# Altium schematic sheet power.SchDoc
size A4
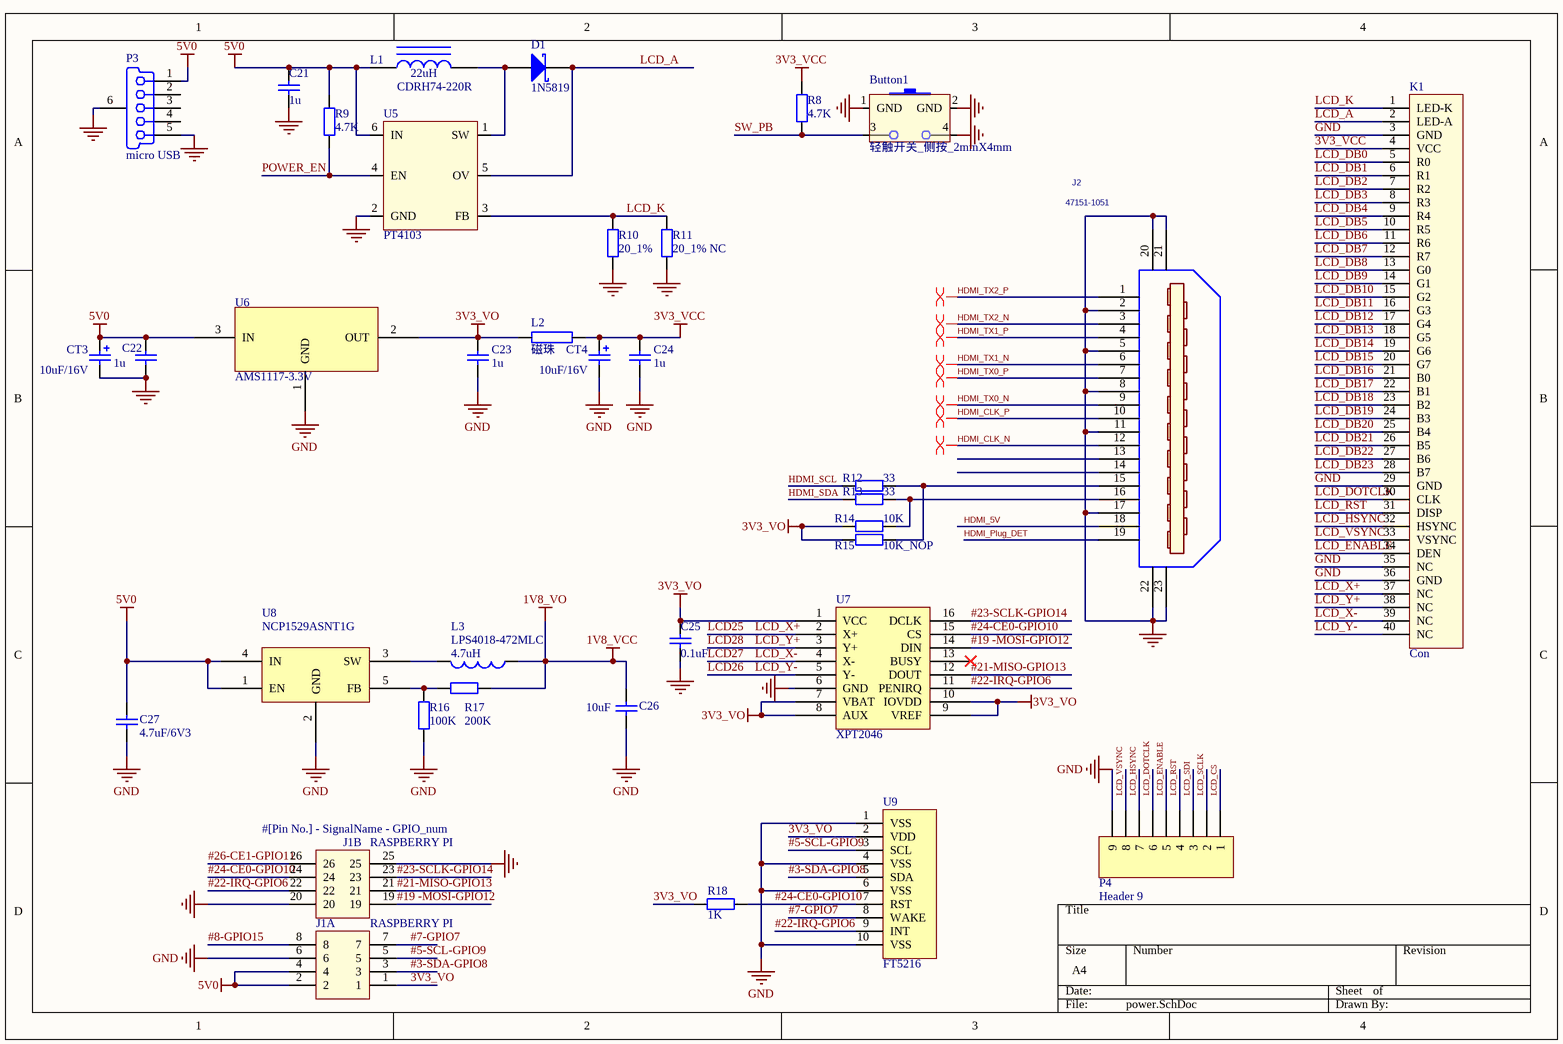
[diagram p0: power.SchDoc]

## Parts
Button1  轻触开关_侧按_2mmX4mm  [轻触开关_侧按_2mmX4mm]
C21  1u  [0603S-CAP]
C22  1u  [0603S-CAP]
C23  1u  [0603S-CAP]
C24  1u  [0603S-CAP]
C25  0.1uF  [0603S-CAP]
C26  10uF  [0603S-CAP]
C27  4.7uF/6V3  [0603S-CAP]
CT3  10uF/16V  [钽电容（A型）]
CT4  10uF/16V  [钽电容（A型）]
D1  1N5819  [SMA]
J1  RASPBERRY PI  [HDR2X20]  (parts A,B of 2)
J2  47151-1051  [47151-1051]
K1  Con  [ER-TFT028-4 -B]
L1  CDRH74-220R  [CDRH74-220R 7*7*4]
L2  磁珠  [L0603]
L3  LPS4018-472MLC  value 4.7uH  [LVF404015N]
P3  micro USB  [FCI_10118194-0001]
P4  Header 9  [HDR1X9]
R8  4.7K  [0603S-RES]
R9  4.7K  [0603S-RES]
R10  20_1%  [0603S-RES]
R11  20_1% NC  [0603S-RES]
R12  33  [0603S-RES]
R13  33  [0603S-RES]
R14  10K  [0603S-RES]
R15  10K_NOP  [0603S-RES]
R16  100K  [0603S-RES]
R17  200K  [0603S-RES]
R18  1K  [0603S-RES]
U5  PT4103  [SOT23-6N]
U6  AMS1117-3.3V  [SOT-223]
U7  XPT2046  [ADS7843]
U8  NCP1529ASNT1G  [SOT23-5]
U9  FT5216  [FT5216]

## Nets
1V8_VCC: C26.1 L3.1 R17.1  [also labelled 1V8_VO]
3V3_VCC: C24.2 CT4.1 K1.4(VCC) L2.1 R8.2
3V3_VO: C23.2 C25.2 J1.1 L2.2 R14.2 R15.2 R18.1 U6.2(OUT) U7.1(VCC) U7.7(VBAT) U7.8(AUX) U7.9(VREF) U7.10(IOVDD) U9.2(VDD)
5V0: C21.2 C22.2 C27.1 CT3.1 J1.2 J1.4 L1.1 P3.1(V_BUS_(5V)) R9.2 U5.6(IN) U6.3(IN) U8.1(EN) U8.4(IN)
GND: Button1.1(GND) Button1.2(GND) Button1.4 C21.1 C22.1 C23.1 C24.1 C25.1 C26.2 C27.2 CT3.2 CT4.2 J1.6 J1.20 J1.25 J2.2(P2) J2.5(P5) J2.8(P8) J2.11(P11) J2.17(P17) J2.20(SH1) J2.21(SH2) J2.22(SH3) J2.23(SH4) K1.3(GND) K1.29(GND) K1.35(NC) K1.36(GND) P3.5(GND) P3.6(Tab) P4.9 R10.2 R11.2 R16.1 U5.2(GND) U6.1(GND) U7.6(GND) U8.2(GND) U9.1(VSS) U9.4(VSS) U9.6(VSS) U9.10(VSS)
#3-SDA-GPIO8: J1.3 U9.5(SDA)
#5-SCL-GPIO9: J1.5 U9.3(SCL)
#7-GPIO7: J1.7 U9.8(WAKE)
#8-GPIO15: J1.8
#19 -MOSI-GPIO12: J1.19 U7.14(DIN)
#21-MISO-GPIO13: J1.21 U7.12(DOUT)
#22-IRQ-GPIO6: J1.22 U7.11(PENIRQ) U9.9(INT)
#23-SCLK-GPIO14: J1.23 U7.16(DCLK)
#24-CE0-GPIO10: J1.24 R18.2 U7.15(CS) U9.7(RST)
#26-CE1-GPIO11: J1.26
HDMI_5V: J2.18(P18)
HDMI_CLK_N: J2.12(P12)
HDMI_CLK_P: J2.10(P10)
HDMI_Plug_DET: J2.19(P19)
HDMI_SCL: R12.2
HDMI_SDA: R13.2
HDMI_TX0_N: J2.9(P9)
HDMI_TX0_P: J2.7(P7)
HDMI_TX1_N: J2.6(P6)
HDMI_TX1_P: J2.4(P4)
HDMI_TX2_N: J2.3(P3)
HDMI_TX2_P: J2.1(P1)
LCD25: K1.37(NC) U7.2(X+)  [also labelled LCD_X+]
LCD26: K1.40(NC) U7.5(Y-)  [also labelled LCD_Y-]
LCD27: K1.39(NC) U7.4(X-)  [also labelled LCD_X-]
LCD28: K1.38(NC) U7.3(Y+)  [also labelled LCD_Y+]
LCD_A: D1.K K1.2(LED-A) U5.5(OV)
LCD_CS: P4.1
LCD_DB0: K1.5(R0)
LCD_DB1: K1.6(R1)
LCD_DB2: K1.7(R2)
LCD_DB3: K1.8(R3)
LCD_DB4: K1.9(R4)
LCD_DB5: K1.10(R5)
LCD_DB6: K1.11(R6)
LCD_DB7: K1.12(R7)
LCD_DB8: K1.13(G0)
LCD_DB9: K1.14(G1)
LCD_DB10: K1.15(G2)
LCD_DB11: K1.16(G3)
LCD_DB12: K1.17(G4)
LCD_DB13: K1.18(G5)
LCD_DB14: K1.19(G6)
LCD_DB15: K1.20(G7)
LCD_DB16: K1.21(B0)
LCD_DB17: K1.22(B1)
LCD_DB18: K1.23(B2)
LCD_DB19: K1.24(B3)
LCD_DB20: K1.25(B4)
LCD_DB21: K1.26(B5)
LCD_DB22: K1.27(B6)
LCD_DB23: K1.28(B7)
LCD_DOTCLK: K1.30(CLK) P4.6
LCD_ENABLE: K1.34(DEN) P4.5
LCD_HSYNC: K1.32(HSYNC) P4.7
LCD_K: K1.1(LED-K) R10.1 R11.1 U5.3(FB)
LCD_RST: K1.31(DISP) P4.4
LCD_SCLK: P4.2
LCD_SDI: P4.3
LCD_VSYNC: K1.33(VSYNC) P4.8
POWER_EN: R9.1 U5.4(EN)
SW_PB: Button1.3 R8.1
NetD1_A: D1.A L1.2 U5.1(SW)
NetJ2_15: J2.15(P15) R12.1 R15.1
NetJ2_16: J2.16(P16) R13.1 R14.1
NetL3_2: L3.2 U8.3(SW)
NetR16_2: R16.2 R17.2 U8.5(FB)

Not connected (* = marked no-connect by the designer): J2 13(P13) 14(P14); P3 2(D-) 3(D+) 4(NC); U7 13(BUSY)*

## Layout directives
differential pair: HDMI_CLK_N, HDMI_CLK_P, HDMI_TX0_N, HDMI_TX0_P, HDMI_TX1_N, HDMI_TX1_P, HDMI_TX2_N, HDMI_TX2_P

## Notes on the sheet
- (near J1) #[Pin No.] - SignalName - GPIO_num
- (in symbol Inductor) 22uH

## Library data of the parts
C21 C23-C25 = Cap: 50V/8.2u/0805; Value: 100n; Published: 8-Jun-2000; LatestRevisionDate: 17-Jul-2002; LatestRevisionNote: Re-released for DXP Platform.; PackageReference: RAD-0.3; Publisher: Altium Limited
C22 = Cap: Capacitor; Value: 0.1u; Published: 8-Jun-2000; LatestRevisionDate: 17-Jul-2002; LatestRevisionNote: Re-released for DXP Platform.; PackageReference: RAD-0.3; Publisher: Altium Limited
C26 C27 = Cap: Capacitor; Value: 100pF; Published: 8-Jun-2000; LatestRevisionDate: 17-Jul-2002; LatestRevisionNote: Re-released for DXP Platform.; PackageReference: RAD-0.3; Publisher: Altium Limited
CT3 CT4 = Cap Pol2: Polarized Capacitor (Axial); Value: 100pF; Published: 8-Jun-2000; LatestRevisionDate: 17-Jul-2002; LatestRevisionNote: Re-released for DXP Platform.; PackageReference: POLAR0.8; Publisher: Altium Limited
D1 = Diode BAT17: Silicon RF Schottky Diode for Mixer Applications in the VHF/UHF Range; Note: Pin 2 is not connected and not drawn.; Published: 21-Mar-2003; LatestRevisionDate: 29-May-2009; LatestRevisionNote: IPC-7351 Footprint Added.; DatasheetVersion: Oct-1999; PackageVersion: Sep-2001; PackageReference: SOT-23; Publisher: Altium Limited; PackageDescription: 3-Pin SOT-23 Package 0.95 mm Pitch, 2.5 mm Lead Span; ComponentLink1Description: Manufacturer Link; ComponentLink1URL: http://www.infineon.com/; ComponentLink2Description: Datasheet; ComponentLink2URL: http://www.infineon.com/upload/Document/cmc_upload/documents/009/363/bat17series.pdf
J2 = CON_HDMI_RA: HDMI Con, RA, SMT with PTH lugs; Manufacturer: Molex; Manuf. Part No: 47151-1051
L1 = Inductor: Manufacturer: Vishay Dale; Manufacturer Part Number: IFSC1515AHER2R2M01; Inductance: 2.2µH; Tolerance: ?0%; Current Rating: 3A; Shielding: Shielded; DC Resistance (DCR): 45 mOhm Max; Frequency - Test: 100kHz; Supplier 1: Digi-Key; Supplier Part Number 1: 541-1404-1-ND; RoHS: RoHS Compliant; Category: Inductors, Coils, Chokes; Stock 1: 26507; Pricing 1: 1=0.51, 10=0.417, 100=0.3475, 500=0.278, 1000=0.2502 (USD); Packaging: Cut Tape (CT); Type: -; Material - Core: -; Current - Saturation: 3A; Q @ Freq: -; Frequency - Self Resonant: -; Operating Temperature: -55°C ~ 125°C; Mounting Type: Surface Mount; Package / Case: Non Standard; Size / Dimension: 0.150" L x 0.150" W (3.80mm x 3.80mm); Height - Seated (Max): 0.075" (1.90mm); Supplier Device Package: -; ComponentLink1URL: http://www.vishay.com/docs/34295/sc15ah01.pdf; ComponentLink1Description: http://www.vishay.com/docs/34295/sc15ah01.pdf
L2 = RES
L3 = Inductor: Code_IEC: 1005; Published: 8-Jun-2000; LatestRevisionDate: 29-May-2009; LatestRevisionNote: IPC-7351 Footprint Added.; PackageReference: 0402-A; Publisher: Altium Limited; PackageDescription: Chip Inductor; Code_JEITA: 0402
P3 = 0481900001: Connector Receptacle USB - micro AB 2.0 5 Position Through Hole, Vertical; Manufacturer: Wurth Electronics Inc
P4 = Header 9: Header, 9-Pin; LatestRevisionDate: 17-Jul-2002; LatestRevisionNote: Re-released for DXP Platform.; Publisher: Altium Limited
R8-R15 R18 = Res2: Resistor; Value: 49.9; Published: 8-Jun-2000; LatestRevisionDate: 17-Jul-2002; LatestRevisionNote: Re-released for DXP Platform.; PackageReference: AXIAL-0.4; Publisher: Altium Limited
R16 R17 = Res2: Resistor; Value: 10K; Published: 8-Jun-2000; LatestRevisionDate: 17-Jul-2002; LatestRevisionNote: Re-released for DXP Platform.; PackageReference: AXIAL-0.4; Publisher: Altium Limited
U6 = AMS1117
U7 = ADS7843